# EAGLE design Wall_plug (EAGLE 7.3.0)
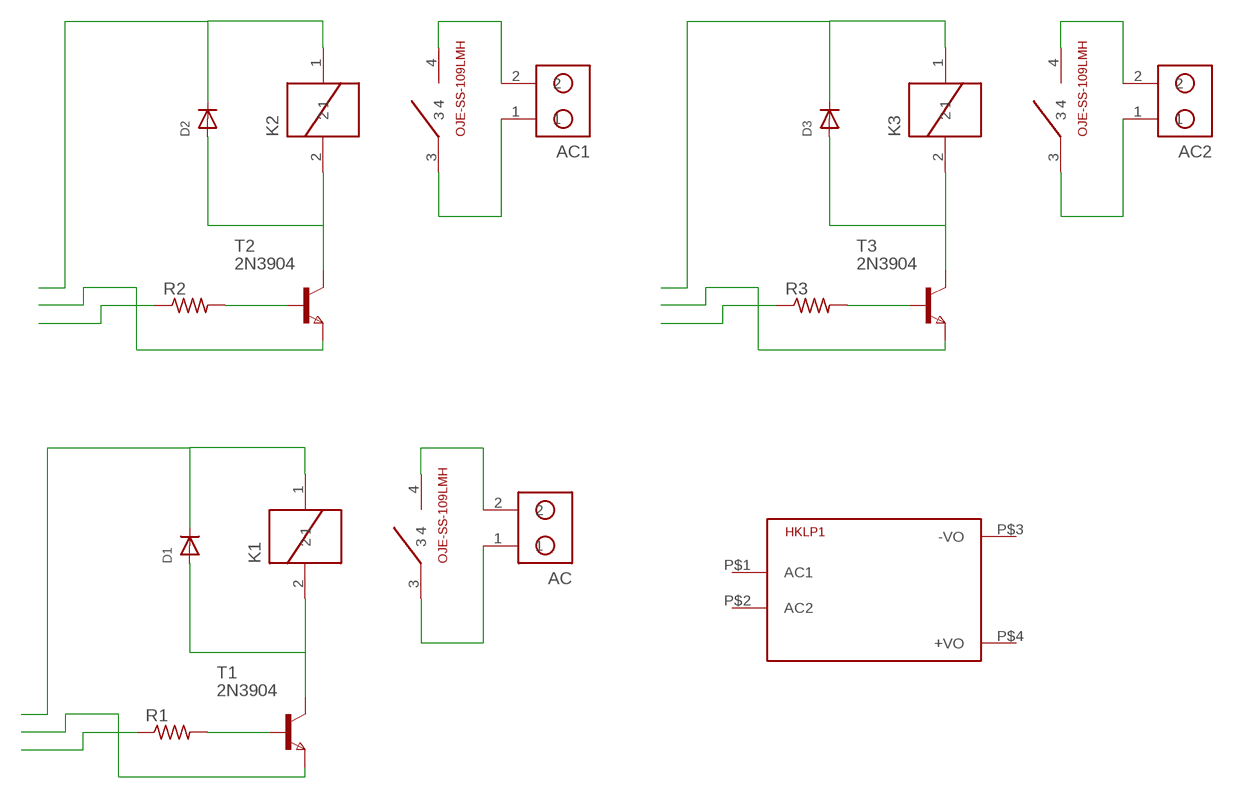
[diagram p0: schematic, sheet 1]

## Parts
AC  TBLOCK1X2  [TBLOCK1X2]
AC1  TBLOCK1X2  [TBLOCK1X2]
AC2  TBLOCK1X2  [TBLOCK1X2]
D1  DIODESMA  [SMADIODE]
D2  DIODESMA  [SMADIODE]
D3  DIODESMA  [SMADIODE]
HKLP1  HKLPM01  [HKLPM01]
K1  OJE-SS-109LMH  [OJE-SS-109LMH]
K2  OJE-SS-109LMH  [OJE-SS-109LMH]
K3  OJE-SS-109LMH  [OJE-SS-109LMH]
R1  R-US_R0603  [R0603]
R2  R-US_R0603  [R0603]
R3  R-US_R0603  [R0603]
T1  2N3904  FMMT451  [SOT-23]
T2  2N3904  FMMT451  [SOT-23]
T3  2N3904  FMMT451  [SOT-23]

## Nets
N$1: D1.A K1.2 T1.1(C)
N$2: D1.C K1.1
N$3: R1.1
N$4: AC.2 K1.4
N$5: T2.2(E)
N$6: R2.2 T2.3(B)
N$7: T1.2(E)
N$8: R1.2 T1.3(B)
N$9: D2.A K2.2 T2.1(C)
N$10: D2.C K2.1
N$11: AC.1 K1.3
N$12: AC1.2 K2.4
N$13: AC1.1 K2.3
N$14: R2.1
N$15: T3.2(E)
N$16: R3.2 T3.3(B)
N$17: D3.A K3.2 T3.1(C)
N$18: D3.C K3.1
N$19: AC2.2 K3.4
N$20: AC2.1 K3.3
N$21: R3.1
Unconnected: HKLP1.P$1(AC1) HKLP1.P$2(AC2) HKLP1.P$3(-VO) HKLP1.P$4(+VO)

## Library data of the parts
AC AC1 AC2 = userdefined:TBLOCK1X2
D1-D3 = adafruit:DIODE: Diode SMADIODE - SMA Surface Mount Package 20V 1A Schottky Diode Digikey: 641-1014-6-ND DO-1N4148 - Through Hole Small Current Diode SOD-123 20V 1 A (.5mV Vf) Schottky Diode - Digikey: MBRX120TPMSCT-ND SOD-323 10V 570mA (.38mV Vf, 3ns) Schottky Diode - Digikey: ZLLS410CT-ND SOD-523 30V 30mA Schottky Diode (RB751S-40TE61) - Digikey: RB751S-40TE61CT-ND SOT23-R/W - SOT23 Package (R = Solder Paste/Reflow Ovens, W = Hand-Soldering) BAT54Film 40V 300mA - Digikey: 497-7162-1-ND
HKLP1 = HKLPM01:HKLPM01
K1-K3 = userdefined:OJE-SS-109LMH
R1-R3 = resistor:R-US_: RESISTOR, American symbol
T1-T3 = zetex:FMMT451: NPN TRANSISTOR; OC_FARNELL: unknown; OC_NEWARK: unknown

## Board
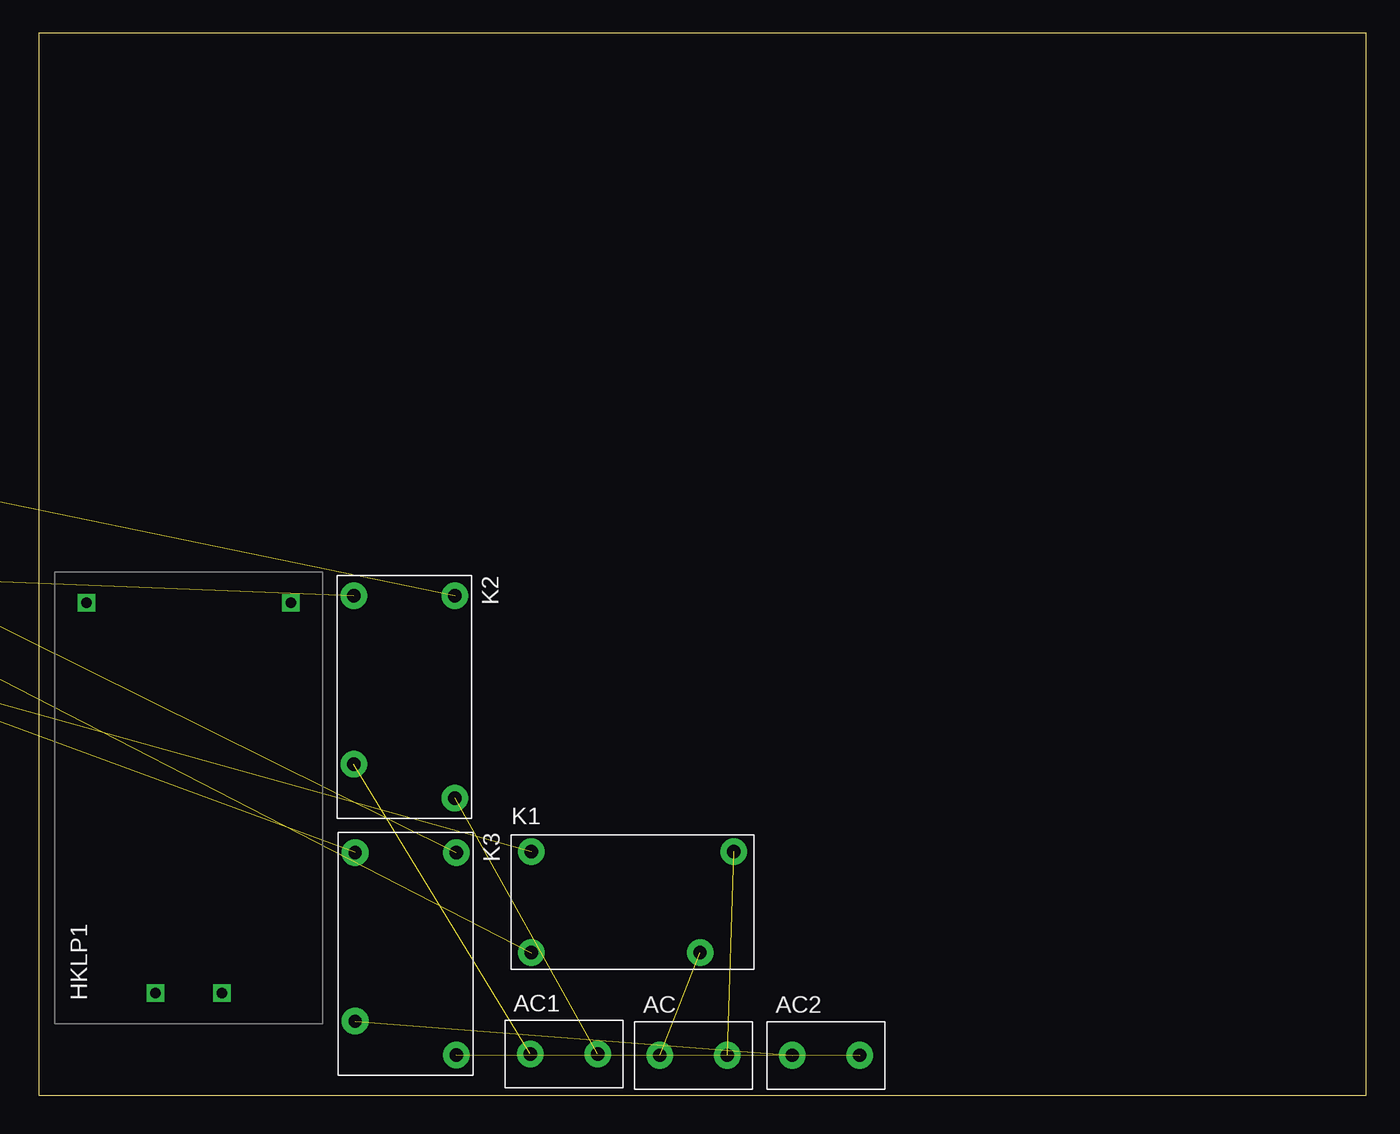
[diagram p1: board, top side]
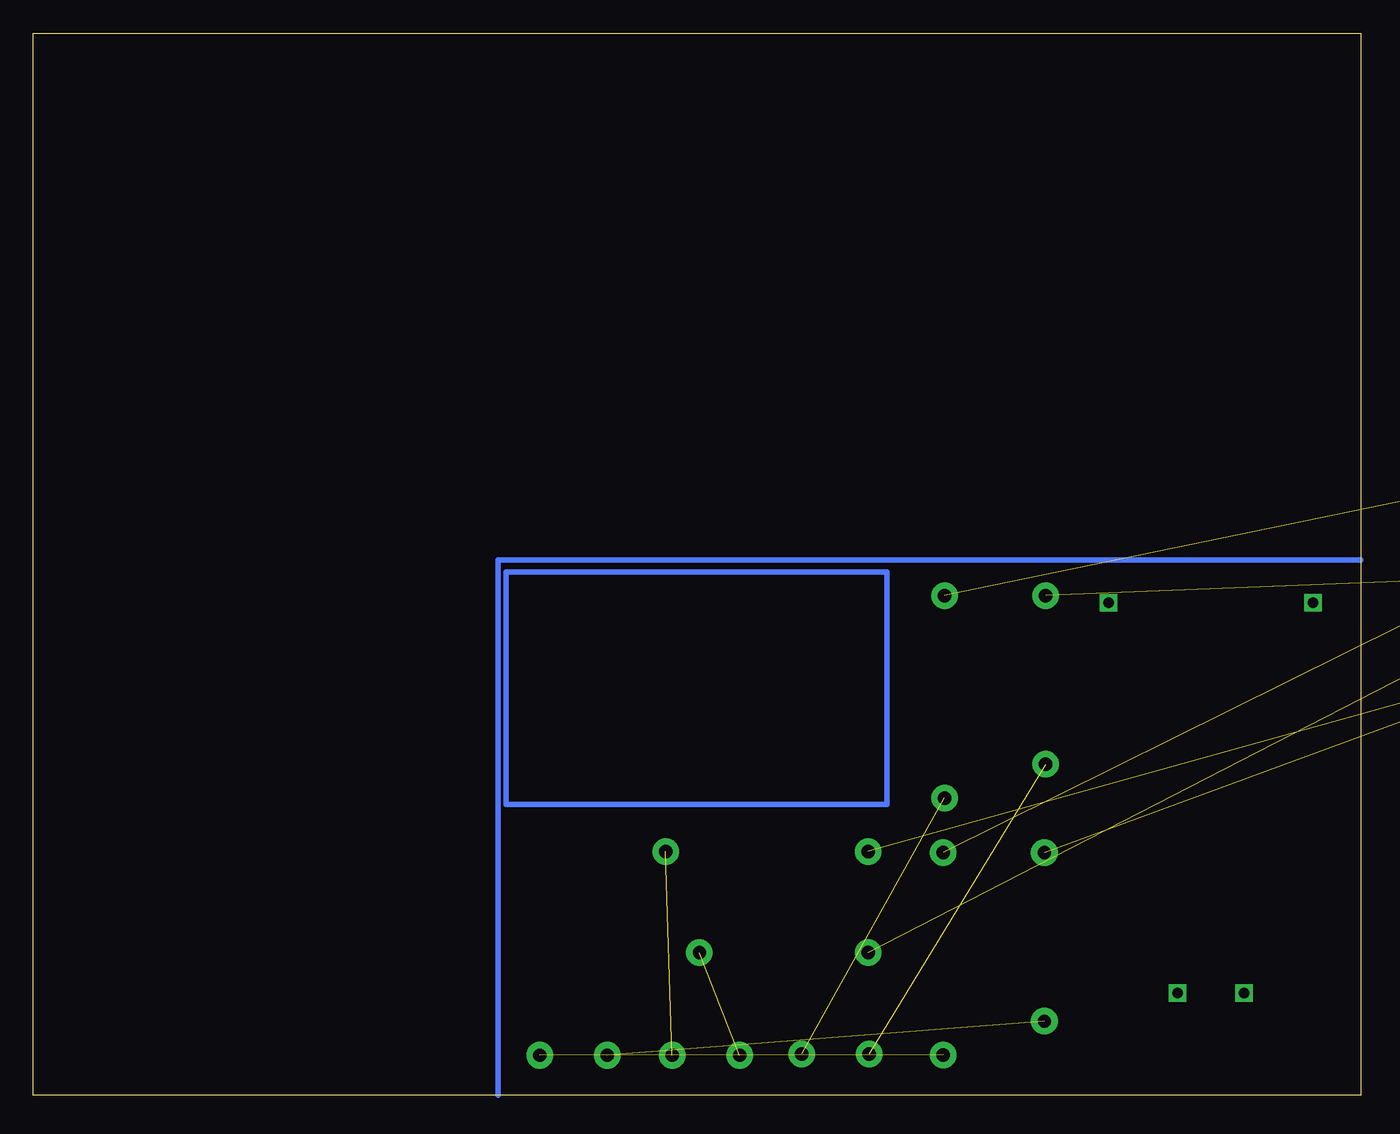
[diagram p2: board, bottom side, seen from below]

Size 100 x 80 mm. Coordinates in mm from the lower left corner, seen from the top.
Outline: 0,0 100,0 100,80 0,80 0,0
Copper layers (1*16): Top 0.035mm / dielectric 1.5mm / Bottom 0.035mm
Design rules "default": minimum track width 10mil, minimum drill 24mil, track to track 8mil, track to pad 8mil, pad to pad 8mil, via to via 8mil, smd to smd 8mil, copper to edge 40mil, drill to drill 8mil, minimum pad ring 10mil, minimum via ring 8mil, stop-mask expansion 4mil, vias tented up to drill 0mil, thermal gap 10mil

### Footprints (pad centres in the part's own frame; a part is rotated, then mirrored left to right if it is on the bottom)
TBLOCK1X2 = drill 1 pad 2: 1 -2.54,0; 2 2.54,0
SMADIODE = smd 2.54 x 2.54: A 2.349,0; C -2.349,0
HKLPM01 = drill 0.8 square: P$1 -14.7,2.5; P$2 -14.7,-2.5; P$3 14.7,7.7; P$4 14.7,-7.7
OJE-SS-109LMH = drill 1 pad 2: 1 -7.62,3.81; 2 -7.62,-3.81; 3 5.08,-3.81; 4 7.62,3.81
R0603 = smd 1 x 1.1: 1 -0.85,0; 2 0.85,0
SOT-23 = smd 0.787 x 0.889: 1 0.025,-1.016; 2 -0.94,1.016; 3 0.991,1.016

### Placement (x,y rotation side)
AC  49.33,3.01 0 top
AC1  39.57,3.11 0 top
AC2  59.31,3.01 0 top
D1  -40.64,40.64 0 top  (outside the outline)
D2  -17.78,48.26 0 top  (outside the outline)
D3  -26.67,48.26 0 top  (outside the outline)
HKLP1  11.3,22.4 90 top
K1  44.74,14.55 0 top
K2  27.55,30.01 270 top
K3  27.65,10.66 270 top
R1  -33.02,46.99 0 top  (outside the outline)
R2  -36.83,46.99 0 top  (outside the outline)
R3  -40.64,46.99 0 top  (outside the outline)
T1  -19.05,40.64 0 top  (outside the outline)
T2  -26.67,40.64 0 top  (outside the outline)
T3  -34.29,40.64 0 top  (outside the outline)

### Tracks (layer width: path | path; a pad name or v marks a point on that pad's centre or on a via)
N$1  (2 unrouted)
N$2  (1 unrouted)
N$4  (1 unrouted)
N$6  (1 unrouted)
N$8  (1 unrouted)
N$9  (2 unrouted)
N$10  (1 unrouted)
N$11  (1 unrouted)
N$12  (1 unrouted)
N$13  (1 unrouted)
N$16  (1 unrouted)
N$17  (2 unrouted)
N$18  (1 unrouted)
N$19  (1 unrouted)
N$20  (1 unrouted)
N$22
  Bottom 0.406: 0,40.3 65,40.3 65,0
N$23
  Bottom 0.406: 35.7,21.9 35.7,39.4 64.4,39.4 64.4,21.9 35.7,21.9